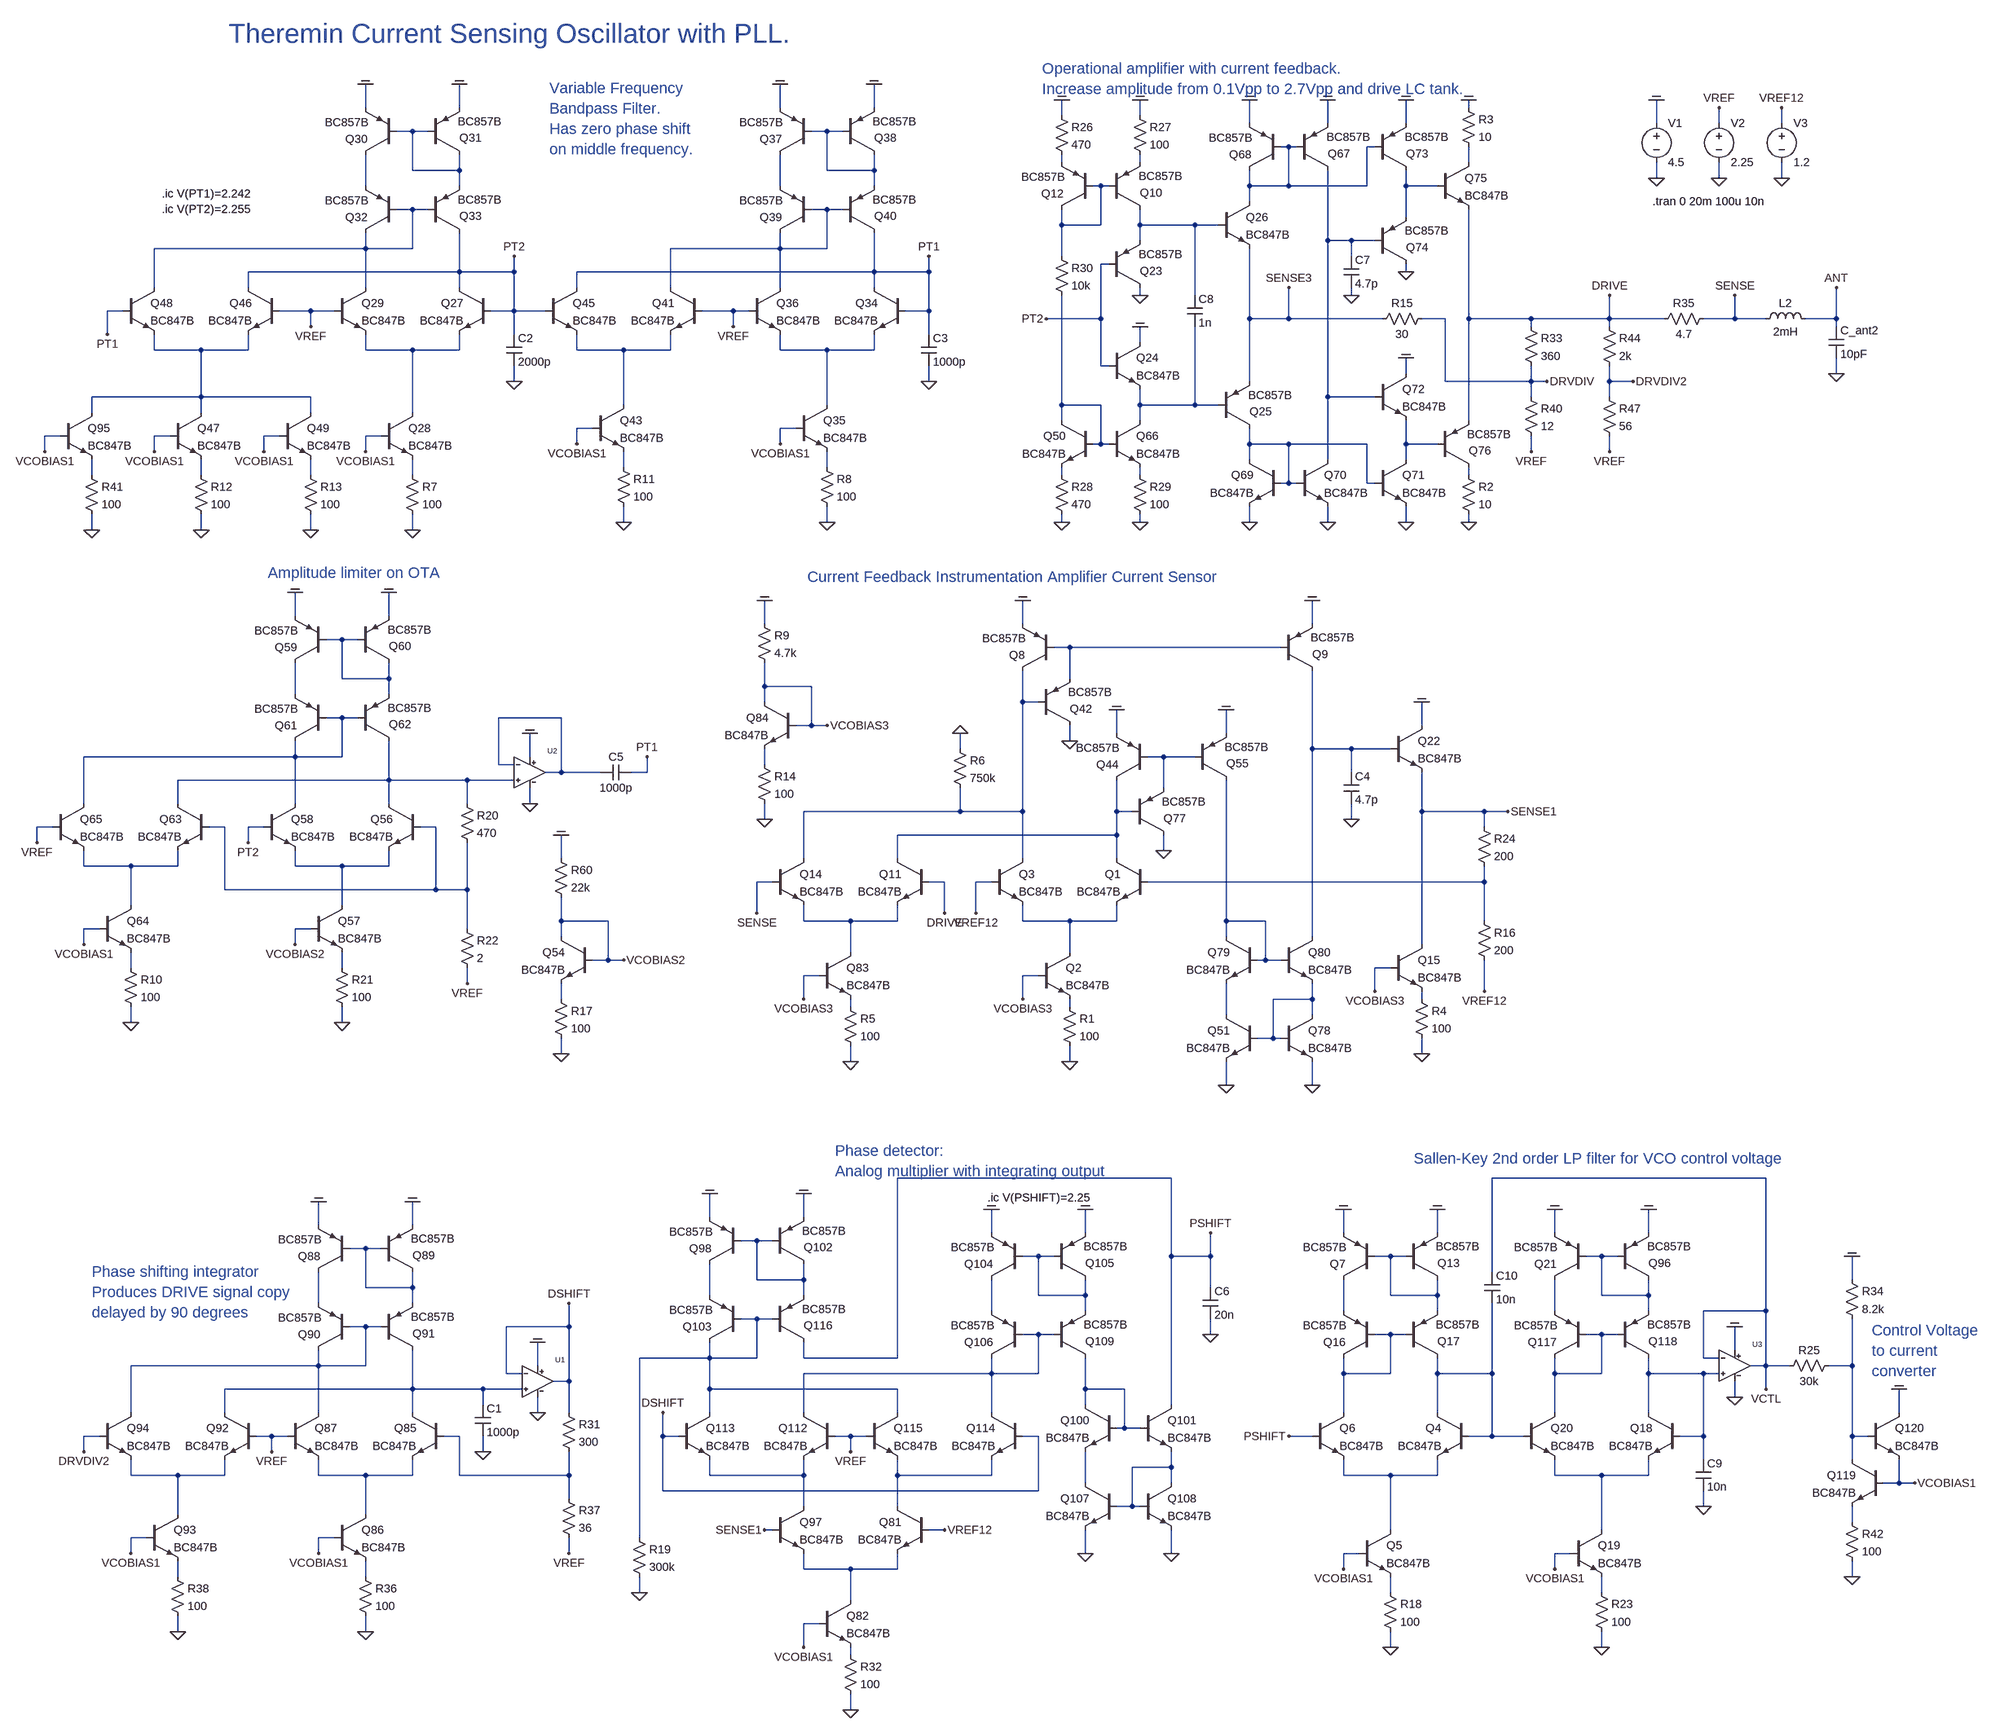
[diagram p0: schematic vco_and_lc_drive_v02.asc]
vco_and_lc_drive_v02.asc, the LTspice schematic file:
Version 4
SHEET 1 13504 21184
WIRE -5552 15856 -5552 15808
WIRE -5360 15856 -5360 15808
WIRE -4704 15856 -4704 15808
WIRE -4512 15856 -4512 15808
WIRE -3296 15856 -3296 15840
WIRE -4128 15872 -4128 15840
WIRE -3968 15872 -3968 15840
WIRE -3744 15888 -3744 15840
WIRE -3584 15888 -3584 15840
WIRE -3424 15888 -3424 15840
WIRE -2912 15888 -2912 15840
WIRE -2784 15888 -2784 15856
WIRE -2656 15888 -2656 15856
WIRE -5456 15904 -5488 15904
WIRE -5424 15904 -5456 15904
WIRE -4608 15904 -4640 15904
WIRE -4576 15904 -4608 15904
WIRE -3664 15936 -3680 15936
WIRE -3648 15936 -3664 15936
WIRE -3488 15936 -3504 15936
WIRE -4128 15968 -4128 15952
WIRE -3968 15968 -3968 15952
WIRE -3296 15968 -3296 15936
WIRE -5456 15984 -5456 15904
WIRE -5360 15984 -5360 15952
WIRE -5360 15984 -5456 15984
WIRE -4608 15984 -4608 15904
WIRE -4512 15984 -4512 15952
WIRE -4512 15984 -4608 15984
WIRE -2912 16000 -2912 15968
WIRE -2784 16000 -2784 15968
WIRE -2656 16000 -2656 15968
WIRE -5552 16016 -5552 15952
WIRE -5360 16016 -5360 15984
WIRE -4704 16016 -4704 15952
WIRE -4512 16016 -4512 15984
WIRE -4048 16016 -4064 16016
WIRE -4032 16016 -4048 16016
WIRE -3744 16016 -3744 15984
WIRE -3664 16016 -3664 15936
WIRE -3664 16016 -3744 16016
WIRE -3504 16016 -3504 15936
WIRE -3504 16016 -3664 16016
WIRE -3424 16016 -3424 15984
WIRE -3360 16016 -3424 16016
WIRE -3744 16048 -3744 16016
WIRE -5456 16064 -5488 16064
WIRE -5424 16064 -5456 16064
WIRE -4608 16064 -4640 16064
WIRE -4576 16064 -4608 16064
WIRE -3424 16080 -3424 16016
WIRE -4128 16096 -4128 16064
WIRE -4048 16096 -4048 16016
WIRE -4048 16096 -4128 16096
WIRE -3968 16096 -3968 16064
WIRE -3856 16096 -3968 16096
WIRE -3808 16096 -3856 16096
WIRE -3968 16128 -3968 16096
WIRE -3584 16128 -3584 15984
WIRE -3536 16128 -3584 16128
WIRE -3488 16128 -3536 16128
WIRE -5552 16144 -5552 16112
WIRE -5552 16144 -5984 16144
WIRE -5456 16144 -5456 16064
WIRE -5456 16144 -5552 16144
WIRE -4704 16144 -4704 16112
WIRE -4704 16144 -4928 16144
WIRE -4608 16144 -4608 16064
WIRE -4608 16144 -4704 16144
WIRE -4128 16160 -4128 16096
WIRE -3536 16160 -3536 16128
WIRE -4032 16176 -4048 16176
WIRE -5360 16192 -5360 16112
WIRE -5360 16192 -5792 16192
WIRE -5248 16192 -5248 16160
WIRE -5248 16192 -5360 16192
WIRE -4512 16192 -4512 16112
WIRE -4512 16192 -5120 16192
WIRE -4400 16192 -4400 16160
WIRE -4400 16192 -4512 16192
WIRE -3424 16192 -3424 16176
WIRE -5984 16224 -5984 16144
WIRE -5792 16224 -5792 16192
WIRE -5552 16224 -5552 16144
WIRE -5360 16224 -5360 16192
WIRE -5120 16224 -5120 16192
WIRE -4928 16224 -4928 16144
WIRE -4704 16224 -4704 16144
WIRE -4512 16224 -4512 16192
WIRE -3968 16240 -3968 16224
WIRE -3856 16240 -3856 16096
WIRE -3536 16240 -3536 16224
WIRE -6048 16272 -6080 16272
WIRE -5664 16272 -5728 16272
WIRE -5616 16272 -5664 16272
WIRE -5248 16272 -5248 16192
WIRE -5248 16272 -5296 16272
WIRE -5184 16272 -5248 16272
WIRE -4800 16272 -4864 16272
WIRE -4768 16272 -4800 16272
WIRE -4400 16272 -4400 16192
WIRE -4400 16272 -4448 16272
WIRE -4048 16288 -4048 16176
WIRE -4048 16288 -4160 16288
WIRE -3744 16288 -3744 16144
WIRE -3664 16288 -3664 16224
WIRE -3664 16288 -3744 16288
WIRE -3472 16288 -3664 16288
WIRE -3344 16288 -3392 16288
WIRE -3296 16288 -3296 16064
WIRE -3168 16288 -3296 16288
WIRE -3008 16288 -3008 16240
WIRE -3008 16288 -3168 16288
WIRE -2896 16288 -3008 16288
WIRE -2752 16288 -2752 16240
WIRE -2752 16288 -2816 16288
WIRE -2688 16288 -2752 16288
WIRE -2544 16288 -2544 16224
WIRE -2544 16288 -2608 16288
WIRE -5664 16304 -5664 16272
WIRE -4800 16304 -4800 16272
WIRE -3168 16304 -3168 16288
WIRE -3008 16304 -3008 16288
WIRE -2544 16304 -2544 16288
WIRE -6080 16320 -6080 16272
WIRE -5248 16320 -5248 16272
WIRE -4400 16320 -4400 16272
WIRE -3968 16336 -3968 16304
WIRE -5984 16352 -5984 16320
WIRE -5888 16352 -5984 16352
WIRE -5792 16352 -5792 16320
WIRE -5792 16352 -5888 16352
WIRE -5552 16352 -5552 16320
WIRE -5456 16352 -5552 16352
WIRE -5360 16352 -5360 16320
WIRE -5360 16352 -5456 16352
WIRE -5120 16352 -5120 16320
WIRE -5024 16352 -5120 16352
WIRE -4928 16352 -4928 16320
WIRE -4928 16352 -5024 16352
WIRE -4704 16352 -4704 16320
WIRE -4608 16352 -4704 16352
WIRE -4512 16352 -4512 16320
WIRE -4512 16352 -4608 16352
WIRE -4048 16384 -4048 16288
WIRE -4032 16384 -4048 16384
WIRE -3424 16400 -3424 16368
WIRE -2544 16400 -2544 16368
WIRE -5248 16416 -5248 16384
WIRE -4400 16416 -4400 16384
WIRE -3744 16416 -3744 16288
WIRE -3344 16416 -3344 16288
WIRE -3168 16416 -3168 16384
WIRE -3168 16416 -3344 16416
WIRE -3136 16416 -3168 16416
WIRE -3008 16416 -3008 16384
WIRE -2960 16416 -3008 16416
WIRE -5888 16448 -5888 16352
WIRE -5888 16448 -6112 16448
WIRE -5664 16448 -5888 16448
WIRE -3584 16448 -3584 16128
WIRE -3488 16448 -3584 16448
WIRE -3168 16448 -3168 16416
WIRE -3008 16448 -3008 16416
WIRE -5024 16464 -5024 16352
WIRE -4608 16464 -4608 16352
WIRE -4128 16464 -4128 16240
WIRE -4048 16464 -4128 16464
WIRE -3968 16464 -3968 16432
WIRE -3856 16464 -3856 16304
WIRE -3856 16464 -3968 16464
WIRE -3808 16464 -3856 16464
WIRE -6112 16480 -6112 16448
WIRE -5888 16480 -5888 16448
WIRE -5664 16480 -5664 16448
WIRE -5456 16480 -5456 16352
WIRE -4128 16496 -4128 16464
WIRE -3968 16496 -3968 16464
WIRE -3296 16496 -3296 16288
WIRE -5088 16512 -5120 16512
WIRE -4672 16512 -4704 16512
WIRE -6176 16528 -6208 16528
WIRE -5952 16528 -5984 16528
WIRE -5728 16528 -5760 16528
WIRE -5520 16528 -5552 16528
WIRE -5120 16544 -5120 16512
WIRE -4704 16544 -4704 16512
WIRE -4048 16544 -4048 16464
WIRE -4048 16544 -4064 16544
WIRE -4032 16544 -4048 16544
WIRE -3744 16544 -3744 16512
WIRE -3664 16544 -3744 16544
WIRE -3504 16544 -3664 16544
WIRE -3424 16544 -3424 16496
WIRE -3360 16544 -3424 16544
WIRE -6208 16560 -6208 16528
WIRE -5984 16560 -5984 16528
WIRE -5760 16560 -5760 16528
WIRE -5552 16560 -5552 16528
WIRE -3168 16560 -3168 16528
WIRE -3008 16560 -3008 16528
WIRE -3744 16576 -3744 16544
WIRE -3584 16576 -3584 16448
WIRE -3424 16576 -3424 16544
WIRE -5024 16592 -5024 16560
WIRE -4608 16592 -4608 16560
WIRE -6112 16608 -6112 16576
WIRE -5888 16608 -5888 16576
WIRE -5664 16608 -5664 16576
WIRE -5456 16608 -5456 16576
WIRE -4128 16608 -4128 16592
WIRE -3968 16608 -3968 16592
WIRE -3296 16608 -3296 16592
WIRE -3664 16624 -3664 16544
WIRE -3664 16624 -3680 16624
WIRE -3648 16624 -3664 16624
WIRE -3504 16624 -3504 16544
WIRE -3488 16624 -3504 16624
WIRE -5024 16704 -5024 16672
WIRE -4608 16704 -4608 16672
WIRE -4128 16704 -4128 16688
WIRE -3968 16704 -3968 16688
WIRE -3744 16704 -3744 16672
WIRE -3584 16704 -3584 16672
WIRE -3424 16704 -3424 16672
WIRE -3296 16704 -3296 16688
WIRE -6112 16720 -6112 16688
WIRE -5888 16720 -5888 16688
WIRE -5664 16720 -5664 16688
WIRE -5456 16720 -5456 16688
WIRE -5696 16896 -5696 16848
WIRE -5504 16896 -5504 16848
WIRE -4736 16912 -4736 16864
WIRE -4208 16912 -4208 16864
WIRE -3616 16912 -3616 16864
WIRE -5600 16944 -5632 16944
WIRE -5568 16944 -5600 16944
WIRE -4112 16960 -4144 16960
WIRE -3680 16960 -4112 16960
WIRE -5600 17024 -5600 16944
WIRE -5504 17024 -5504 16992
WIRE -5504 17024 -5600 17024
WIRE -4112 17024 -4112 16960
WIRE -4736 17040 -4736 16992
WIRE -4640 17040 -4736 17040
WIRE -5696 17056 -5696 16992
WIRE -5504 17056 -5504 17024
WIRE -4736 17072 -4736 17040
WIRE -4208 17072 -4208 17008
WIRE -4176 17072 -4208 17072
WIRE -5600 17104 -5632 17104
WIRE -5568 17104 -5600 17104
WIRE -5152 17104 -5280 17104
WIRE -4640 17120 -4640 17040
WIRE -4640 17120 -4672 17120
WIRE -4608 17120 -4640 17120
WIRE -3392 17120 -3392 17072
WIRE -4016 17136 -4016 17088
WIRE -3792 17136 -3792 17088
WIRE -4112 17152 -4112 17120
WIRE -4336 17168 -4336 17136
WIRE -3616 17168 -3616 17008
WIRE -3536 17168 -3616 17168
WIRE -3456 17168 -3536 17168
WIRE -5696 17184 -5696 17152
WIRE -5696 17184 -6128 17184
WIRE -5600 17184 -5600 17104
WIRE -5600 17184 -5696 17184
WIRE -5216 17184 -5216 17136
WIRE -3920 17184 -3952 17184
WIRE -3856 17184 -3920 17184
WIRE -5280 17200 -5280 17104
WIRE -5248 17200 -5280 17200
WIRE -4736 17200 -4736 17168
WIRE -5152 17216 -5152 17104
WIRE -5152 17216 -5184 17216
WIRE -5072 17216 -5152 17216
WIRE -4976 17216 -4976 17184
WIRE -4976 17216 -5008 17216
WIRE -3536 17216 -3536 17168
WIRE -5504 17232 -5504 17152
WIRE -5504 17232 -5936 17232
WIRE -5344 17232 -5504 17232
WIRE -5248 17232 -5344 17232
WIRE -3920 17248 -3920 17184
WIRE -6128 17280 -6128 17184
WIRE -5936 17280 -5936 17232
WIRE -5696 17280 -5696 17184
WIRE -5504 17280 -5504 17232
WIRE -5344 17280 -5344 17232
WIRE -5216 17280 -5216 17248
WIRE -4336 17296 -4336 17248
WIRE -4336 17296 -4656 17296
WIRE -4208 17296 -4208 17072
WIRE -4208 17296 -4336 17296
WIRE -4016 17296 -4016 17232
WIRE -3984 17296 -4016 17296
WIRE -3392 17296 -3392 17216
WIRE -3264 17296 -3392 17296
WIRE -3216 17296 -3264 17296
WIRE -4736 17312 -4736 17280
WIRE -3536 17312 -3536 17280
WIRE -6192 17328 -6224 17328
WIRE -5840 17328 -5872 17328
WIRE -5760 17328 -5792 17328
WIRE -5408 17328 -5440 17328
WIRE -3264 17328 -3264 17296
WIRE -4016 17344 -4016 17296
WIRE -4016 17344 -4464 17344
WIRE -6224 17360 -6224 17328
WIRE -5792 17360 -5792 17328
WIRE -3920 17376 -3920 17344
WIRE -5152 17392 -5152 17344
WIRE -4656 17392 -4656 17296
WIRE -4464 17392 -4464 17344
WIRE -4208 17392 -4208 17296
WIRE -4016 17392 -4016 17344
WIRE -6128 17408 -6128 17376
WIRE -6032 17408 -6128 17408
WIRE -5936 17408 -5936 17376
WIRE -5936 17408 -6032 17408
WIRE -5696 17408 -5696 17376
WIRE -5600 17408 -5696 17408
WIRE -5504 17408 -5504 17376
WIRE -5504 17408 -5600 17408
WIRE -4720 17440 -4752 17440
WIRE -4368 17440 -4400 17440
WIRE -4272 17440 -4304 17440
WIRE -3264 17440 -3264 17408
WIRE -3264 17440 -3952 17440
WIRE -5840 17456 -5840 17328
WIRE -5408 17456 -5408 17328
WIRE -5408 17456 -5840 17456
WIRE -5344 17456 -5344 17360
WIRE -5344 17456 -5408 17456
WIRE -6032 17488 -6032 17408
WIRE -5600 17488 -5600 17408
WIRE -4752 17504 -4752 17440
WIRE -4368 17504 -4368 17440
WIRE -4304 17504 -4304 17440
WIRE -5152 17520 -5152 17472
WIRE -5056 17520 -5152 17520
WIRE -4656 17520 -4656 17488
WIRE -4560 17520 -4656 17520
WIRE -4464 17520 -4464 17488
WIRE -4464 17520 -4560 17520
WIRE -4208 17520 -4208 17488
WIRE -4112 17520 -4208 17520
WIRE -4016 17520 -4016 17488
WIRE -4016 17520 -4112 17520
WIRE -3792 17520 -3792 17232
WIRE -3712 17520 -3792 17520
WIRE -3264 17520 -3264 17440
WIRE -6096 17536 -6128 17536
WIRE -5664 17536 -5696 17536
WIRE -5344 17536 -5344 17456
WIRE -5152 17552 -5152 17520
WIRE -3792 17552 -3792 17520
WIRE -3616 17552 -3616 17168
WIRE -6128 17568 -6128 17536
WIRE -5696 17568 -5696 17536
WIRE -3392 17568 -3392 17296
WIRE -4560 17584 -4560 17520
WIRE -4112 17584 -4112 17520
WIRE -5056 17600 -5056 17520
WIRE -5056 17600 -5088 17600
WIRE -5024 17600 -5056 17600
WIRE -3712 17600 -3712 17520
WIRE -3712 17600 -3728 17600
WIRE -3680 17600 -3712 17600
WIRE -6032 17616 -6032 17584
WIRE -5600 17616 -5600 17584
WIRE -3456 17616 -3488 17616
WIRE -4624 17632 -4656 17632
WIRE -4176 17632 -4208 17632
WIRE -5344 17648 -5344 17616
WIRE -3488 17664 -3488 17616
WIRE -3264 17664 -3264 17600
WIRE -5152 17680 -5152 17648
WIRE -4656 17680 -4656 17632
WIRE -4208 17680 -4208 17632
WIRE -3616 17680 -3616 17648
WIRE -3616 17680 -3696 17680
WIRE -3392 17680 -3392 17664
WIRE -4560 17696 -4560 17680
WIRE -4112 17696 -4112 17680
WIRE -3792 17712 -3792 17648
WIRE -3616 17712 -3616 17680
WIRE -6032 17728 -6032 17696
WIRE -5600 17728 -5600 17696
WIRE -3696 17760 -3696 17680
WIRE -3696 17760 -3728 17760
WIRE -3680 17760 -3696 17760
WIRE -5152 17792 -5152 17760
WIRE -3392 17792 -3392 17760
WIRE -4560 17808 -4560 17776
WIRE -4112 17808 -4112 17776
WIRE -3792 17856 -3792 17808
WIRE -3616 17856 -3616 17808
WIRE -3904 18096 -4464 18096
WIRE -2688 18096 -3248 18096
WIRE -4848 18176 -4848 18128
WIRE -4656 18176 -4656 18128
WIRE -5648 18192 -5648 18144
WIRE -5456 18192 -5456 18144
WIRE -4272 18208 -4272 18160
WIRE -4080 18208 -4080 18160
WIRE -3552 18208 -3552 18160
WIRE -3360 18208 -3360 18160
WIRE -3120 18208 -3120 18160
WIRE -2928 18208 -2928 18160
WIRE -4752 18224 -4784 18224
WIRE -4720 18224 -4752 18224
WIRE -5552 18240 -5584 18240
WIRE -5520 18240 -5552 18240
WIRE -4176 18256 -4208 18256
WIRE -4144 18256 -4176 18256
WIRE -3904 18256 -3904 18096
WIRE -3824 18256 -3824 18208
WIRE -3824 18256 -3904 18256
WIRE -3456 18256 -3488 18256
WIRE -3424 18256 -3456 18256
WIRE -3024 18256 -3056 18256
WIRE -2992 18256 -3024 18256
WIRE -3248 18288 -3248 18096
WIRE -4752 18304 -4752 18224
WIRE -4656 18304 -4656 18272
WIRE -4656 18304 -4752 18304
WIRE -2512 18304 -2512 18256
WIRE -5552 18320 -5552 18240
WIRE -5456 18320 -5456 18288
WIRE -5456 18320 -5552 18320
WIRE -3824 18320 -3824 18256
WIRE -4848 18336 -4848 18272
WIRE -4656 18336 -4656 18304
WIRE -4176 18336 -4176 18256
WIRE -4080 18336 -4080 18304
WIRE -4080 18336 -4176 18336
WIRE -3456 18336 -3456 18256
WIRE -3360 18336 -3360 18304
WIRE -3360 18336 -3456 18336
WIRE -3024 18336 -3024 18256
WIRE -2928 18336 -2928 18304
WIRE -2928 18336 -3024 18336
WIRE -5648 18352 -5648 18288
WIRE -5456 18352 -5456 18320
WIRE -4272 18368 -4272 18304
WIRE -4080 18368 -4080 18336
WIRE -3552 18368 -3552 18304
WIRE -3360 18368 -3360 18336
WIRE -3120 18368 -3120 18304
WIRE -2928 18368 -2928 18336
WIRE -2688 18368 -2688 18096
WIRE -2688 18368 -2816 18368
WIRE -4752 18384 -4784 18384
WIRE -4720 18384 -4752 18384
WIRE -5552 18400 -5584 18400
WIRE -5520 18400 -5552 18400
WIRE -5136 18400 -5136 18352
WIRE -5136 18400 -5264 18400
WIRE -4176 18416 -4208 18416
WIRE -4144 18416 -4176 18416
WIRE -3824 18416 -3824 18384
WIRE -3456 18416 -3488 18416
WIRE -3424 18416 -3456 18416
WIRE -3024 18416 -3056 18416
WIRE -2992 18416 -3024 18416
WIRE -2752 18448 -2752 18400
WIRE -4848 18464 -4848 18432
WIRE -4848 18464 -4992 18464
WIRE -4752 18464 -4752 18384
WIRE -4752 18464 -4848 18464
WIRE -4656 18464 -4656 18432
WIRE -4464 18464 -4464 18096
WIRE -4464 18464 -4656 18464
WIRE -2816 18464 -2816 18368
WIRE -2784 18464 -2816 18464
WIRE -5648 18480 -5648 18448
WIRE -5648 18480 -6032 18480
WIRE -5552 18480 -5552 18400
WIRE -5552 18480 -5648 18480
WIRE -5200 18480 -5200 18432
WIRE -2688 18480 -2688 18368
WIRE -2688 18480 -2720 18480
WIRE -2640 18480 -2688 18480
WIRE -2512 18480 -2512 18384
WIRE -2512 18480 -2560 18480
WIRE -5264 18496 -5264 18400
WIRE -5232 18496 -5264 18496
WIRE -4272 18496 -4272 18464
WIRE -4272 18496 -4656 18496
WIRE -4176 18496 -4176 18416
WIRE -4176 18496 -4272 18496
WIRE -3552 18496 -3552 18464
WIRE -3456 18496 -3456 18416
WIRE -3456 18496 -3552 18496
WIRE -3360 18496 -3360 18464
WIRE -3248 18496 -3248 18352
WIRE -3248 18496 -3360 18496
WIRE -3120 18496 -3120 18464
WIRE -3024 18496 -3024 18416
WIRE -3024 18496 -3120 18496
WIRE -2928 18496 -2928 18464
WIRE -2816 18496 -2928 18496
WIRE -2784 18496 -2816 18496
WIRE -5136 18512 -5136 18400
WIRE -5136 18512 -5168 18512
WIRE -5456 18528 -5456 18448
WIRE -5456 18528 -5840 18528
WIRE -5312 18528 -5456 18528
WIRE -5232 18528 -5312 18528
WIRE -4848 18528 -4848 18464
WIRE -4464 18528 -4848 18528
WIRE -4080 18528 -4080 18464
WIRE -4000 18528 -4080 18528
WIRE -2688 18528 -2688 18480
WIRE -2752 18544 -2752 18512
WIRE -5312 18560 -5312 18528
WIRE -4080 18560 -4080 18528
WIRE -3904 18560 -3904 18256
WIRE -6032 18576 -6032 18480
WIRE -5840 18576 -5840 18528
WIRE -5648 18576 -5648 18480
WIRE -5456 18576 -5456 18528
WIRE -5200 18576 -5200 18544
WIRE -5136 18576 -5136 18512
WIRE -4848 18576 -4848 18528
WIRE -4656 18576 -4656 18496
WIRE -4464 18576 -4464 18528
WIRE -4272 18576 -4272 18496
WIRE -3552 18576 -3552 18496
WIRE -3360 18576 -3360 18496
WIRE -3120 18576 -3120 18496
WIRE -2928 18576 -2928 18496
WIRE -2416 18576 -2416 18528
WIRE -4000 18608 -4000 18528
WIRE -4000 18608 -4016 18608
WIRE -3968 18608 -4000 18608
WIRE -6096 18624 -6128 18624
WIRE -5744 18624 -5776 18624
WIRE -5712 18624 -5744 18624
WIRE -5360 18624 -5392 18624
WIRE -4944 18624 -4944 18576
WIRE -4912 18624 -4944 18624
WIRE -4560 18624 -4592 18624
WIRE -4528 18624 -4560 18624
WIRE -4176 18624 -4208 18624
WIRE -3616 18624 -3664 18624
WIRE -3248 18624 -3248 18496
WIRE -3248 18624 -3296 18624
WIRE -3184 18624 -3248 18624
WIRE -2816 18624 -2816 18496
WIRE -2816 18624 -2864 18624
WIRE -2512 18624 -2512 18480
WIRE -2480 18624 -2512 18624
WIRE -6128 18656 -6128 18624
WIRE -5744 18656 -5744 18624
WIRE -5312 18656 -5312 18624
WIRE -4560 18656 -4560 18624
WIRE -2816 18672 -2816 18624
WIRE -2512 18672 -2512 18624
WIRE -3904 18688 -3904 18656
WIRE -3904 18688 -3984 18688
WIRE -6032 18704 -6032 18672
WIRE -5936 18704 -6032 18704
WIRE -5840 18704 -5840 18672
WIRE -5840 18704 -5936 18704
WIRE -5648 18704 -5648 18672
WIRE -5552 18704 -5648 18704
WIRE -5456 18704 -5456 18672
WIRE -5456 18704 -5552 18704
WIRE -5360 18704 -5360 18624
WIRE -5136 18704 -5136 18656
WIRE -5136 18704 -5360 18704
WIRE -4848 18704 -4848 18672
WIRE -4656 18704 -4656 18672
WIRE -4656 18704 -4848 18704
WIRE -4464 18704 -4464 18672
WIRE -4272 18704 -4272 18672
WIRE -4272 18704 -4464 18704
WIRE -3552 18704 -3552 18672
WIRE -3456 18704 -3552 18704
WIRE -3360 18704 -3360 18672
WIRE -3360 18704 -3456 18704
WIRE -3120 18704 -3120 18672
WIRE -3024 18704 -3120 18704
WIRE -2928 18704 -2928 18672
WIRE -2928 18704 -3024 18704
WIRE -4080 18720 -4080 18656
WIRE -3904 18720 -3904 18688
WIRE -2416 18720 -2416 18672
WIRE -2416 18720 -2448 18720
WIRE -2384 18720 -2416 18720
WIRE -4944 18736 -4944 18624
WIRE -4176 18736 -4176 18624
WIRE -4176 18736 -4944 18736
WIRE -5136 18752 -5136 18704
WIRE -4656 18768 -4656 18704
WIRE -4464 18768 -4464 18704
WIRE -3984 18768 -3984 18688
WIRE -3984 18768 -4016 18768
WIRE -3968 18768 -3984 18768
WIRE -2816 18768 -2816 18736
WIRE -5936 18784 -5936 18704
WIRE -5552 18784 -5552 18704
WIRE -2512 18800 -2512 18768
WIRE -4720 18816 -4736 18816
WIRE -4368 18816 -4400 18816
WIRE -3456 18816 -3456 18704
WIRE -3024 18816 -3024 18704
WIRE -6000 18832 -6032 18832
WIRE -5616 18832 -5648 18832
WIRE -4992 18832 -4992 18464
WIRE -6032 18864 -6032 18832
WIRE -5648 18864 -5648 18832
WIRE -5136 18864 -5136 18832
WIRE -4080 18864 -4080 18816
WIRE -3904 18864 -3904 18816
WIRE -3520 18864 -3552 18864
WIRE -3088 18864 -3120 18864
WIRE -4656 18896 -4656 18864
WIRE -4560 18896 -4656 18896
WIRE -4464 18896 -4464 18864
WIRE -4464 18896 -4560 18896
WIRE -3552 18896 -3552 18864
WIRE -3120 18896 -3120 18864
WIRE -5936 18912 -5936 18880
WIRE -5552 18912 -5552 18880
WIRE -2512 18912 -2512 18880
WIRE -4992 18944 -4992 18912
WIRE -3456 18944 -3456 18912
WIRE -3024 18944 -3024 18912
WIRE -4560 18960 -4560 18896
WIRE -4624 19008 -4656 19008
WIRE -5936 19024 -5936 18992
WIRE -5552 19024 -5552 18992
WIRE -4656 19056 -4656 19008
WIRE -3456 19056 -3456 19024
WIRE -3024 19056 -3024 19024
WIRE -4560 19072 -4560 19056
WIRE -4560 19184 -4560 19152
FLAG -2912 16000 0
FLAG -2912 15840 COM
FLAG -2784 16000 0
FLAG -2784 15856 VREF
FLAG -5152 17344 COM
FLAG -5024 17600 VCOBIAS2
FLAG -5152 17792 0
FLAG -5552 16560 VCOBIAS1
FLAG -5456 16720 0
FLAG -5552 15808 COM
FLAG -5360 15808 COM
FLAG -4704 16544 VCOBIAS1
FLAG -4400 16416 0
FLAG -4704 15808 COM
FLAG -4512 15808 COM
FLAG -5120 16544 VCOBIAS1
FLAG -5024 16704 0
FLAG -4800 16304 VREF
FLAG -5984 16560 VCOBIAS1
FLAG -5888 16720 0
FLAG -5664 16304 VREF
FLAG -5696 17568 VCOBIAS2
FLAG -5344 17648 VREF
FLAG -5600 17728 0
FLAG -5696 16848 COM
FLAG -5504 16848 COM
FLAG -5216 17280 0
FLAG -5216 17136 COM
FLAG -6128 17568 VCOBIAS1
FLAG -6032 17728 0
FLAG -6224 17360 VREF
FLAG -5248 16160 PT2
FLAG -4128 16704 0
FLAG -3968 16704 0
FLAG -3968 15840 COM
FLAG -4128 15840 COM
FLAG -3968 16240 0
FLAG -3968 16304 COM
FLAG -3584 15840 COM
FLAG -3744 15840 COM
FLAG -3744 16704 0
FLAG -3584 16704 0
FLAG -3536 16240 0
FLAG -3424 16704 0
FLAG -3424 16368 COM
FLAG -3424 15840 COM
FLAG -3424 16192 0
FLAG -3296 15840 COM
FLAG -3296 16704 0
FLAG -3168 16560 VREF
FLAG -2544 16400 0
FLAG -2544 16224 ANT
FLAG -2752 16240 SENSE
FLAG -3008 16240 DRIVE
FLAG -3136 16416 DRVDIV
FLAG -2656 16000 0
FLAG -2656 15856 VREF12
FLAG -4112 17808 0
FLAG -4304 17504 VREF12
FLAG -4208 16864 COM
FLAG -3616 16864 COM
FLAG -4208 17680 VCOBIAS3
FLAG -4368 17504 DRIVE
FLAG -4112 17152 0
FLAG -4016 17088 COM
FLAG -3792 17088 COM
FLAG -3920 17376 0
FLAG -4560 17808 0
FLAG -4656 17680 VCOBIAS3
FLAG -4752 17504 SENSE
FLAG -3216 17296 SENSE1
FLAG -4736 16864 COM
FLAG -4608 17120 VCOBIAS3
FLAG -4736 17312 0
FLAG -3264 17664 VREF12
FLAG -5648 18864 VCOBIAS1
FLAG -5136 18864 VREF
FLAG -5552 19024 0
FLAG -5648 18144 COM
FLAG -5456 18144 COM
FLAG -6032 18864 VCOBIAS1
FLAG -5936 19024 0
FLAG -5744 18656 VREF
FLAG -6128 18656 DRVDIV2
FLAG -2960 16416 DRVDIV2
FLAG -4400 16160 PT1
FLAG -4976 17184 PT1
FLAG -6080 16320 PT1
FLAG -5792 17360 PT2
FLAG -5760 16560 VCOBIAS1
FLAG -5664 16720 0
FLAG -6208 16560 VCOBIAS1
FLAG -6112 16720 0
FLAG -4160 16288 PT2
FLAG -3008 16560 VREF
FLAG -5200 18576 0
FLAG -5200 18432 COM
FLAG -3392 17792 0
FLAG -3488 17664 VCOBIAS3
FLAG -3392 17072 COM
FLAG -3536 17312 0
FLAG -4560 19184 0
FLAG -4656 19056 VCOBIAS1
FLAG -4080 18864 0
FLAG -3904 18864 0
FLAG -3824 18208 PSHIFT
FLAG -3824 18416 0
FLAG -4368 18816 VREF12
FLAG -4736 18816 SENSE1
FLAG -5136 18352 DSHIFT
FLAG -4560 18656 VREF
FLAG -4944 18576 DSHIFT
FLAG -4272 18160 COM
FLAG -4080 18160 COM
FLAG -4848 18128 COM
FLAG -4656 18128 COM
FLAG -3552 18896 VCOBIAS1
FLAG -3456 19056 0
FLAG -3552 18160 COM
FLAG -3360 18160 COM
FLAG -3120 18896 VCOBIAS1
FLAG -3024 19056 0
FLAG -3120 18160 COM
FLAG -2928 18160 COM
FLAG -2816 18768 0
FLAG -2752 18544 0
FLAG -2752 18400 COM
FLAG -3664 18624 PSHIFT
FLAG -3792 17856 0
FLAG -3616 17856 0
FLAG -4336 17136 0
FLAG -2512 18256 COM
FLAG -2384 18720 VCOBIAS1
FLAG -2416 18528 COM
FLAG -2512 18912 0
FLAG -5248 16416 0
FLAG -4608 16704 0
FLAG -2688 18528 VCTL
FLAG -5312 18656 0
FLAG -3664 16224 SENSE3
FLAG -4992 18944 0
SYMBOL voltage -2912 15872 R0
SYMATTR InstName V1
SYMATTR Value 4.5
SYMBOL Voltage -2784 15872 R0
SYMATTR InstName V2
SYMATTR Value 2.25
SYMBOL Res -5168 17376 R0
SYMATTR InstName R60
SYMATTR Value 22k
SYMBOL npn -5088 17552 M0
SYMATTR InstName Q54
SYMATTR Value BC847B
SYMBOL Res -5168 17664 R0
SYMATTR InstName R17
SYMATTR Value 100
SYMBOL npn -5296 16224 M0
SYMATTR InstName Q27
SYMATTR Value BC847B
SYMBOL npn -5520 16480 R0
SYMATTR InstName Q28
SYMATTR Value BC847B
SYMBOL npn -5616 16224 R0
SYMATTR InstName Q29
SYMATTR Value BC847B
SYMBOL Res -5472 16592 R0
SYMATTR InstName R7
SYMATTR Value 100
SYMBOL pnp -5488 15952 R180
WINDOW 0 60 32 Left 2
WINDOW 3 58 66 Left 2
SYMATTR InstName Q30
SYMATTR Value BC857B
SYMBOL pnp -5424 15952 M180
WINDOW 0 64 34 Left 2
WINDOW 3 61 68 Left 2
SYMATTR InstName Q31
SYMATTR Value BC857B
SYMBOL pnp -5488 16112 R180
WINDOW 0 60 32 Left 2
WINDOW 3 58 66 Left 2
SYMATTR InstName Q32
SYMATTR Value BC857B
SYMBOL pnp -5424 16112 M180
WINDOW 0 64 34 Left 2
WINDOW 3 61 68 Left 2
SYMATTR InstName Q33
SYMATTR Value BC857B
SYMBOL npn -4448 16224 M0
SYMATTR InstName Q34
SYMATTR Value BC847B
SYMBOL npn -4672 16464 R0
SYMATTR InstName Q35
SYMATTR Value BC847B
SYMBOL npn -4768 16224 R0
SYMATTR InstName Q36
SYMATTR Value BC847B
SYMBOL Res -4624 16576 R0
SYMATTR InstName R8
SYMATTR Value 100
SYMBOL pnp -4640 15952 R180
WINDOW 0 60 32 Left 2
WINDOW 3 58 66 Left 2
SYMATTR InstName Q37
SYMATTR Value BC857B
SYMBOL pnp -4576 15952 M180
WINDOW 0 64 34 Left 2
WINDOW 3 61 68 Left 2
SYMATTR InstName Q38
SYMATTR Value BC857B
SYMBOL pnp -4640 16112 R180
WINDOW 0 60 32 Left 2
WINDOW 3 58 66 Left 2
SYMATTR InstName Q39
SYMATTR Value BC857B
SYMBOL pnp -4576 16112 M180
WINDOW 0 64 34 Left 2
WINDOW 3 61 68 Left 2
SYMATTR InstName Q40
SYMATTR Value BC857B
SYMBOL Cap -5264 16320 R0
SYMATTR InstName C2
SYMATTR Value 2000p
SYMBOL Cap -5008 17200 R90
WINDOW 0 0 32 VBottom 2
WINDOW 3 32 32 VTop 2
SYMATTR InstName C5
SYMATTR Value 1000p
SYMBOL npn -4864 16224 M0
SYMATTR InstName Q41
SYMATTR Value BC847B
SYMBOL npn -5088 16464 R0
SYMATTR InstName Q43
SYMATTR Value BC847B
SYMBOL npn -5184 16224 R0
SYMATTR InstName Q45
SYMATTR Value BC847B
SYMBOL Res -5040 16576 R0
SYMATTR InstName R11
SYMATTR Value 100
SYMBOL npn -5728 16224 M0
SYMATTR InstName Q46
SYMATTR Value BC847B
SYMBOL npn -5952 16480 R0
SYMATTR InstName Q47
SYMATTR Value BC847B
SYMBOL npn -6048 16224 R0
SYMATTR InstName Q48
SYMATTR Value BC847B
SYMBOL Res -5904 16592 R0
SYMATTR InstName R12
SYMATTR Value 100
SYMBOL npn -5440 17280 M0
SYMATTR InstName Q56
SYMATTR Value BC847B
SYMBOL npn -5664 17488 R0
SYMATTR InstName Q57
SYMATTR Value BC847B
SYMBOL npn -5760 17280 R0
SYMATTR InstName Q58
SYMATTR Value BC847B
SYMBOL Res -5360 17264 R0
SYMATTR InstName R20
SYMATTR Value 470
SYMBOL Res -5616 17600 R0
SYMATTR InstName R21
SYMATTR Value 100
SYMBOL Res -5360 17520 R0
SYMATTR InstName R22
SYMATTR Value 2
SYMBOL pnp -5632 16992 R180
WINDOW 0 60 32 Left 2
WINDOW 3 58 66 Left 2
SYMATTR InstName Q59
SYMATTR Value BC857B
SYMBOL pnp -5568 16992 M180
WINDOW 0 64 34 Left 2
WINDOW 3 61 68 Left 2
SYMATTR InstName Q60
SYMATTR Value BC857B
SYMBOL pnp -5632 17152 R180
WINDOW 0 60 32 Left 2
WINDOW 3 58 66 Left 2
SYMATTR InstName Q61
SYMATTR Value BC857B
SYMBOL pnp -5568 17152 M180
WINDOW 0 64 34 Left 2
WINDOW 3 61 68 Left 2
SYMATTR InstName Q62
SYMATTR Value BC857B
SYMBOL MCP6021 -5216 17216 R0
SYMATTR InstName U2
SYMBOL npn -5872 17280 M0
SYMATTR InstName Q63
SYMATTR Value BC847B
SYMBOL npn -6096 17488 R0
SYMATTR InstName Q64
SYMATTR Value BC847B
SYMBOL npn -6192 17280 R0
SYMATTR InstName Q65
SYMATTR Value BC847B
SYMBOL Res -6048 17600 R0
SYMATTR InstName R10
SYMATTR Value 100
SYMBOL pnp -4032 16064 M180
WINDOW 0 64 34 Left 2
WINDOW 3 61 68 Left 2
SYMATTR InstName Q10
SYMATTR Value BC857B
SYMBOL pnp -4064 16064 R180
WINDOW 0 60 32 Left 2
WINDOW 3 58 66 Left 2
SYMATTR InstName Q12
SYMATTR Value BC857B
SYMBOL pnp -4032 16224 M180
WINDOW 0 64 34 Left 2
WINDOW 3 61 68 Left 2
SYMATTR InstName Q23
SYMATTR Value BC857B
SYMBOL npn -4032 16336 R0
SYMATTR InstName Q24
SYMATTR Value BC847B
SYMBOL pnp -3808 16512 M180
WINDOW 0 64 34 Left 2
WINDOW 3 61 68 Left 2
SYMATTR InstName Q25
SYMATTR Value BC857B
SYMBOL npn -3808 16048 R0
SYMATTR InstName Q26
SYMATTR Value BC847B
SYMBOL Res -4144 15856 R0
SYMATTR InstName R26
SYMATTR Value 470
SYMBOL Res -3984 15856 R0
SYMATTR InstName R27
SYMATTR Value 100
SYMBOL Res -4144 16592 R0
SYMATTR InstName R28
SYMATTR Value 470
SYMBOL Res -3984 16592 R0
SYMATTR InstName R29
SYMATTR Value 100
SYMBOL npn -4064 16496 M0
SYMATTR InstName Q50
SYMATTR Value BC847B
SYMBOL npn -4032 16496 R0
SYMATTR InstName Q66
SYMATTR Value BC847B
SYMBOL Res -4144 16144 R0
SYMATTR InstName R30
SYMATTR Value 10k
SYMBOL pnp -3648 15984 M180
WINDOW 0 64 34 Left 2
WINDOW 3 61 68 Left 2
SYMATTR InstName Q67
SYMATTR Value BC857B
SYMBOL pnp -3680 15984 R180
WINDOW 0 60 32 Left 2
WINDOW 3 58 66 Left 2
SYMATTR InstName Q68
SYMATTR Value BC857B
SYMBOL npn -3680 16576 M0
SYMATTR InstName Q69
SYMATTR Value BC847B
SYMBOL npn -3648 16576 R0
SYMATTR InstName Q70
SYMATTR Value BC847B
SYMBOL Cap -3552 16160 R0
SYMATTR InstName C7
SYMATTR Value 4.7p
SYMBOL npn -3488 16576 R0
SYMATTR InstName Q71
SYMATTR Value BC847B
SYMBOL npn -3488 16400 R0
SYMATTR InstName Q72
SYMATTR Value BC847B
SYMBOL pnp -3488 15984 M180
WINDOW 0 64 34 Left 2
WINDOW 3 61 68 Left 2
SYMATTR InstName Q73
SYMATTR Value BC857B
SYMBOL pnp -3488 16176 M180
WINDOW 0 64 34 Left 2
WINDOW 3 61 68 Left 2
SYMATTR InstName Q74
SYMATTR Value BC857B
SYMBOL npn -3360 15968 R0
SYMATTR InstName Q75
SYMATTR Value BC847B
SYMBOL pnp -3360 16592 M180
WINDOW 0 64 34 Left 2
WINDOW 3 61 68 Left 2
SYMATTR InstName Q76
SYMATTR Value BC857B
SYMBOL Res -3184 16288 R0
SYMATTR InstName R33
SYMATTR Value 360
SYMBOL ind -2704 16304 R270
WINDOW 0 32 56 VTop 2
WINDOW 3 5 56 VBottom 2
SYMATTR InstName L2
SYMATTR Value 2mH
SYMATTR SpiceLine Rser=120 Cpar=1pF
SYMBOL Cap -2560 16304 R0
SYMATTR InstName C_ant2
SYMATTR Value 10pF
SYMBOL Res -2912 16304 R270
WINDOW 0 32 56 VTop 2
WINDOW 3 0 56 VBottom 2
SYMATTR InstName R35
SYMATTR Value 4.7
SYMBOL Cap -3872 16240 R0
SYMATTR InstName C8
SYMATTR Value 1n
SYMBOL Res -3312 16592 R0
SYMATTR InstName R2
SYMATTR Value 10
SYMBOL Res -3312 15840 R0
SYMATTR InstName R3
SYMATTR Value 10
SYMBOL Voltage -2656 15872 R0
SYMATTR InstName V3
SYMATTR Value 1.2
SYMBOL npn -3952 17392 M0
SYMATTR InstName Q1
SYMATTR Value BC847B
SYMBOL npn -4176 17584 R0
SYMATTR InstName Q2
SYMATTR Value BC847B
SYMBOL Res -4128 17680 R0
SYMATTR InstName R1
SYMATTR Value 100
SYMBOL npn -4272 17392 R0
SYMATTR InstName Q3
SYMATTR Value BC847B
SYMBOL pnp -4144 17008 R180
WINDOW 0 60 32 Left 2
WINDOW 3 58 66 Left 2
SYMATTR InstName Q8
SYMATTR Value BC857B
SYMBOL pnp -3680 17008 M180
WINDOW 0 64 34 Left 2
WINDOW 3 61 68 Left 2
SYMATTR InstName Q9
SYMATTR Value BC857B
SYMBOL npn -4400 17392 M0
SYMATTR InstName Q11
SYMATTR Value BC847B
SYMBOL npn -4720 17392 R0
SYMATTR InstName Q14
SYMATTR Value BC847B
SYMBOL pnp -4176 17120 M180
WINDOW 0 64 34 Left 2
WINDOW 3 61 68 Left 2
SYMATTR InstName Q42
SYMATTR Value BC857B
SYMBOL pnp -3952 17232 R180
WINDOW 0 60 32 Left 2
WINDOW 3 58 66 Left 2
SYMATTR InstName Q44
SYMATTR Value BC857B
SYMBOL pnp -3856 17232 M180
WINDOW 0 64 34 Left 2
WINDOW 3 61 68 Left 2
SYMATTR InstName Q55
SYMATTR Value BC857B
SYMBOL pnp -3984 17344 M180
WINDOW 0 64 34 Left 2
WINDOW 3 61 68 Left 2
SYMATTR InstName Q77
SYMATTR Value BC857B
SYMBOL npn -4624 17584 R0
SYMATTR InstName Q83
SYMATTR Value BC847B
SYMBOL Res -4576 17680 R0
SYMATTR InstName R5
SYMATTR Value 100
SYMBOL Res -4352 17152 R0
SYMATTR InstName R6
SYMATTR Value 750k
SYMBOL Res -4752 16896 R0
SYMATTR InstName R9
SYMATTR Value 4.7k
SYMBOL npn -4672 17072 M0
SYMATTR InstName Q84
SYMATTR Value BC847B
SYMBOL Res -4752 17184 R0
SYMATTR InstName R14
SYMATTR Value 100
SYMBOL Res -3280 17504 R0
SYMATTR InstName R16
SYMATTR Value 200
SYMBOL Res -3280 17312 R0
SYMATTR InstName R24
SYMATTR Value 200
SYMBOL npn -5392 18576 M0
SYMATTR InstName Q85
SYMATTR Value BC847B
SYMBOL npn -5616 18784 R0
SYMATTR InstName Q86
SYMATTR Value BC847B
SYMBOL npn -5712 18576 R0
SYMATTR InstName Q87
SYMATTR Value BC847B
SYMBOL Res -5568 18896 R0
SYMATTR InstName R36
SYMATTR Value 100
SYMBOL Res -5152 18736 R0
SYMATTR InstName R37
SYMATTR Value 36
SYMBOL pnp -5584 18288 R180
WINDOW 0 60 32 Left 2
WINDOW 3 58 66 Left 2
SYMATTR InstName Q88
SYMATTR Value BC857B
SYMBOL pnp -5520 18288 M180
WINDOW 0 64 34 Left 2
WINDOW 3 61 68 Left 2
SYMATTR InstName Q89
SYMATTR Value BC857B
SYMBOL pnp -5584 18448 R180
WINDOW 0 60 32 Left 2
WINDOW 3 58 66 Left 2
SYMATTR InstName Q90
SYMATTR Value BC857B
SYMBOL pnp -5520 18448 M180
WINDOW 0 64 34 Left 2
WINDOW 3 61 68 Left 2
SYMATTR InstName Q91
SYMATTR Value BC857B
SYMBOL npn -5776 18576 M0
SYMATTR InstName Q92
SYMATTR Value BC847B
SYMBOL npn -6000 18784 R0
SYMATTR InstName Q93
SYMATTR Value BC847B
SYMBOL npn -6096 18576 R0
SYMATTR InstName Q94
SYMATTR Value BC847B
SYMBOL Res -5952 18896 R0
SYMATTR InstName R38
SYMATTR Value 100
SYMBOL Cap -5328 18560 R0
SYMATTR InstName C1
SYMATTR Value 1000p
SYMBOL Res -5152 18560 R0
SYMATTR InstName R31
SYMATTR Value 300
SYMBOL Res -3184 16432 R0
SYMATTR InstName R40
SYMATTR Value 12
SYMBOL Cap -4416 16320 R0
SYMATTR InstName C3
SYMATTR Value 1000p
SYMBOL npn -5728 16480 R0
SYMATTR InstName Q49
SYMATTR Value BC847B
SYMBOL Res -5680 16592 R0
SYMATTR InstName R13
SYMATTR Value 100
SYMBOL npn -6176 16480 R0
SYMATTR InstName Q95
SYMATTR Value BC847B
SYMBOL Res -6128 16592 R0
SYMATTR InstName R41
SYMATTR Value 100
SYMBOL Res -3024 16288 R0
SYMATTR InstName R44
SYMATTR Value 2k
SYMBOL Res -3024 16432 R0
SYMATTR InstName R47
SYMATTR Value 56
SYMBOL MCP6021 -5200 18512 R0
SYMATTR InstName U1
SYMBOL npn -3456 17568 R0
SYMATTR InstName Q15
SYMATTR Value BC847B
SYMBOL Res -3408 17664 R0
SYMATTR InstName R4
SYMATTR Value 100
SYMBOL npn -3456 17120 R0
SYMATTR InstName Q22
SYMATTR Value BC847B
SYMBOL Cap -3552 17216 R0
SYMATTR InstName C4
SYMATTR Value 4.7p
SYMBOL npn -4400 18768 M0
SYMATTR InstName Q81
SYMATTR Value BC847B
SYMBOL npn -4624 18960 R0
SYMATTR InstName Q82
SYMATTR Value BC847B
SYMBOL Res -4576 19056 R0
SYMATTR InstName R32
SYMATTR Value 100
SYMBOL npn -4720 18768 R0
SYMATTR InstName Q97
SYMATTR Value BC847B
SYMBOL npn -4016 18720 M0
SYMATTR InstName Q107
SYMATTR Value BC847B
SYMBOL npn -3968 18720 R0
SYMATTR InstName Q108
SYMATTR Value BC847B
SYMBOL Cap -3840 18320 R0
SYMATTR InstName C6
SYMATTR Value 20n
SYMBOL npn -4592 18576 M0
SYMATTR InstName Q112
SYMATTR Value BC847B
SYMBOL npn -4912 18576 R0
SYMATTR InstName Q113
SYMATTR Value BC847B
SYMBOL npn -4208 18576 M0
SYMATTR InstName Q114
SYMATTR Value BC847B
SYMBOL npn -4528 18576 R0
SYMATTR InstName Q115
SYMATTR Value BC847B
SYMBOL npn -4016 18560 M0
SYMATTR InstName Q100
SYMATTR Value BC847B
SYMBOL npn -3968 18560 R0
SYMATTR InstName Q101
SYMATTR Value BC847B
SYMBOL pnp -4208 18304 R180
WINDOW 0 60 32 Left 2
WINDOW 3 58 66 Left 2
SYMATTR InstName Q104
SYMATTR Value BC857B
SYMBOL pnp -4144 18304 M180
WINDOW 0 64 34 Left 2
WINDOW 3 61 68 Left 2
SYMATTR InstName Q105
SYMATTR Value BC857B
SYMBOL pnp -4208 18464 R180
WINDOW 0 60 32 Left 2
WINDOW 3 58 66 Left 2
SYMATTR InstName Q106
SYMATTR Value BC857B
SYMBOL pnp -4144 18464 M180
WINDOW 0 64 34 Left 2
WINDOW 3 61 68 Left 2
SYMATTR InstName Q109
SYMATTR Value BC857B
SYMBOL pnp -4784 18272 R180
WINDOW 0 60 32 Left 2
WINDOW 3 58 66 Left 2
SYMATTR InstName Q98
SYMATTR Value BC857B
SYMBOL pnp -4720 18272 M180
WINDOW 0 64 34 Left 2
WINDOW 3 61 68 Left 2
SYMATTR InstName Q102
SYMATTR Value BC857B
SYMBOL pnp -4784 18432 R180
WINDOW 0 60 32 Left 2
WINDOW 3 58 66 Left 2
SYMATTR InstName Q103
SYMATTR Value BC857B
SYMBOL pnp -4720 18432 M180
WINDOW 0 64 34 Left 2
WINDOW 3 61 68 Left 2
SYMATTR InstName Q116
SYMATTR Value BC857B
SYMBOL npn -3296 18576 M0
SYMATTR InstName Q4
SYMATTR Value BC847B
SYMBOL npn -3520 18816 R0
SYMATTR InstName Q5
SYMATTR Value BC847B
SYMBOL npn -3616 18576 R0
SYMATTR InstName Q6
SYMATTR Value BC847B
SYMBOL Res -3472 18928 R0
SYMATTR InstName R18
SYMATTR Value 100
SYMBOL pnp -3488 18304 R180
WINDOW 0 60 32 Left 2
WINDOW 3 58 66 Left 2
SYMATTR InstName Q7
SYMATTR Value BC857B
SYMBOL pnp -3424 18304 M180
WINDOW 0 64 34 Left 2
WINDOW 3 61 68 Left 2
SYMATTR InstName Q13
SYMATTR Value BC857B
SYMBOL pnp -3488 18464 R180
WINDOW 0 60 32 Left 2
WINDOW 3 58 66 Left 2
SYMATTR InstName Q16
SYMATTR Value BC857B
SYMBOL pnp -3424 18464 M180
WINDOW 0 64 34 Left 2
WINDOW 3 61 68 Left 2
SYMATTR InstName Q17
SYMATTR Value BC857B
SYMBOL npn -2864 18576 M0
SYMATTR InstName Q18
SYMATTR Value BC847B
SYMBOL npn -3088 18816 R0
SYMATTR InstName Q19
SYMATTR Value BC847B
SYMBOL npn -3184 18576 R0
SYMATTR InstName Q20
SYMATTR Value BC847B
SYMBOL Res -3040 18928 R0
SYMATTR InstName R23
SYMATTR Value 100
SYMBOL pnp -3056 18304 R180
WINDOW 0 60 32 Left 2
WINDOW 3 58 66 Left 2
SYMATTR InstName Q21
SYMATTR Value BC857B
SYMBOL pnp -2992 18304 M180
WINDOW 0 64 34 Left 2
WINDOW 3 61 68 Left 2
SYMATTR InstName Q96
SYMATTR Value BC857B
SYMBOL pnp -3056 18464 R180
WINDOW 0 60 32 Left 2
WINDOW 3 58 66 Left 2
SYMATTR InstName Q117
SYMATTR Value BC857B
SYMBOL pnp -2992 18464 M180
WINDOW 0 64 34 Left 2
WINDOW 3 61 68 Left 2
SYMATTR InstName Q118
SYMATTR Value BC857B
SYMBOL Cap -2832 18672 R0
SYMATTR InstName C9
SYMATTR Value 10n
SYMBOL Cap -3264 18288 R0
SYMATTR InstName C10
SYMATTR Value 10n
SYMBOL MCP6021 -2752 18480 R0
SYMATTR InstName U3
SYMBOL npn -3728 17712 M0
SYMATTR InstName Q51
SYMATTR Value BC847B
SYMBOL npn -3680 17712 R0
SYMATTR InstName Q78
SYMATTR Value BC847B
SYMBOL npn -3728 17552 M0
SYMATTR InstName Q79
SYMATTR Value BC847B
SYMBOL npn -3680 17552 R0
SYMATTR InstName Q80
SYMATTR Value BC847B
SYMBOL Res -2544 18464 R90
WINDOW 0 0 56 VBottom 2
WINDOW 3 32 56 VTop 2
SYMATTR InstName R25
SYMATTR Value 30k
SYMBOL Res -2528 18288 R0
SYMATTR InstName R34
SYMATTR Value 8.2k
SYMBOL npn -2448 18672 M0
SYMATTR InstName Q119
SYMATTR Value BC847B
SYMBOL npn -2480 18576 R0
SYMATTR InstName Q120
SYMATTR Value BC847B
SYMBOL Res -2528 18784 R0
SYMATTR InstName R42
SYMATTR Value 100
SYMBOL Res -3376 16272 R90
WINDOW 0 0 56 VBottom 2
WINDOW 3 32 56 VTop 2
SYMATTR InstName R15
SYMATTR Value 30
SYMBOL Res -5008 18816 R0
SYMATTR InstName R19
SYMATTR Value 300k
TEXT -2920 16048 Left 2 !.tran 0 20m 100u 10n
TEXT -5832 15704 Left 5 ;Theremin Current Sensing Oscillator with PLL.
TEXT -5968 16032 Left 2 !.ic V(PT1)=2.242\n.ic V(PT2)=2.255
TEXT -4168 15776 Left 3 ;Operational amplifier with current feedback.\nIncrease amplitude from 0.1Vpp to 2.7Vpp and drive LC tank.
TEXT -5752 16808 Left 3 ;Amplitude limiter on OTA
TEXT -5176 15816 Left 3 ;Variable Frequency \nBandpass Filter.\nHas zero phase shift \non middle frequency.
TEXT -4648 16816 Left 3 ;Current Feedback Instrumentation Amplifier Current Sensor
TEXT -6112 18288 Left 3 ;Phase shifting integrator\nProduces DRIVE signal copy \ndelayed by 90 degrees
TEXT -4280 18136 Left 2 !.ic V(PSHIFT)=2.25
TEXT -3408 18056 Left 3 ;Sallen-Key 2nd order LP filter for VCO control voltage
TEXT -4592 18040 Left 3 ;Phase detector:\nAnalog multiplier with integrating output
TEXT -2472 18408 Left 3 ;Control Voltage \nto current\nconverter

The netlist it stands for:
* vco_and_lc_drive_v02.asc
V1 COM 0 4.5
V2 VREF 0 2.25
R60 COM VCOBIAS2 22k
Q54 VCOBIAS2 VCOBIAS2 N052 0 BC847B
R17 N052 0 100
Q27 PT2 PT2 N016 0 BC847B
Q28 N016 VCOBIAS1 N028 0 BC847B
Q29 N011 VREF N016 0 BC847B
R7 N028 0 100
Q30 N007 N001 COM 0 BC857B
Q31 N001 N001 COM 0 BC857B
Q32 N011 N011 N007 0 BC857B
Q33 PT2 N011 N001 0 BC857B
Q34 PT1 PT1 N018 0 BC847B
Q35 N018 VCOBIAS1 N024 0 BC847B
Q36 N012 VREF N018 0 BC847B
R8 N024 0 100
Q37 N008 N002 COM 0 BC857B
Q38 N002 N002 COM 0 BC857B
Q39 N012 N012 N008 0 BC857B
Q40 PT1 N012 N002 0 BC857B
C2 PT2 0 2000p
C5 PT1 N037 1000p
Q41 N012 VREF N017 0 BC847B
Q43 N017 VCOBIAS1 N023 0 BC847B
Q45 PT1 PT2 N017 0 BC847B
R11 N023 0 100
Q46 PT2 VREF N015 0 BC847B
Q47 N015 VCOBIAS1 N026 0 BC847B
Q48 N011 PT1 N015 0 BC847B
R12 N026 0 100
Q56 N041 N043 N045 0 BC847B
Q57 N045 VCOBIAS2 N051 0 BC847B
Q58 N036 PT2 N045 0 BC847B
R20 N041 N043 470
R21 N051 0 100
R22 N043 VREF 2
Q59 N034 N032 COM 0 BC857B
Q60 N032 N032 COM 0 BC857B
Q61 N036 N036 N034 0 BC857B
Q62 N041 N036 N032 0 BC857B
XU2 N041 N037 COM 0 N037 MCP6021  ; pins In+ In- V+ V- OUT
Q63 N041 N043 N044 0 BC847B
Q64 N044 VCOBIAS1 N050 0 BC847B
Q65 N036 VREF N044 0 BC847B
R10 N050 0 100
Q10 N013 N009 N005 0 BC857B
Q12 N009 N009 N004 0 BC857B
Q23 0 PT2 N013 0 BC857B
Q24 COM PT2 N020 0 BC847B
Q25 N021 N020 SENSE3 0 BC857B
Q26 N003 N013 SENSE3 0 BC847B
R26 COM N004 470
R27 COM N005 100
R28 N029 0 470
R29 N030 0 100
Q50 N019 N019 N029 0 BC847B
Q66 N020 N019 N030 0 BC847B
R30 N009 N019 10k
Q67 N014 N003 COM 0 BC857B
Q68 N003 N003 COM 0 BC857B
Q69 N021 N021 0 0 BC847B
Q70 N014 N021 0 0 BC847B
C7 N014 0 4.7p
Q71 N022 N021 0 0 BC847B
Q72 COM N014 N022 0 BC847B
Q73 N010 N003 COM 0 BC857B
Q74 0 N014 N010 0 BC857B
Q75 N006 N010 DRIVE 0 BC847B
Q76 N031 N022 DRIVE 0 BC857B
R33 DRIVE DRVDIV 360
L2 SENSE ANT 2mH Rser=120 Cpar=1pF
C_ant2 ANT 0 10pF
R35 DRIVE SENSE 4.7
C8 N013 N020 1n
R2 N031 0 10
R3 COM N006 10
V3 VREF12 0 1.2
Q1 N042 N046 N048 0 BC847B
Q2 N048 VCOBIAS3 N056 0 BC847B
R1 N056 0 100
Q3 N035 VREF12 N048 0 BC847B
Q8 N035 N033 COM 0 BC857B
Q9 N038 N033 COM 0 BC857B
Q11 N042 DRIVE N047 0 BC847B
Q14 N035 SENSE N047 0 BC847B
Q42 0 N035 N033 0 BC857B
Q44 N042 N039 COM 0 BC857B
Q55 N049 N039 COM 0 BC857B
Q77 0 N042 N039 0 BC857B
Q83 N047 VCOBIAS3 N055 0 BC847B
R5 N055 0 100
R6 0 N035 750k
R9 COM VCOBIAS3 4.7k
Q84 VCOBIAS3 VCOBIAS3 N040 0 BC847B
R14 N040 0 100
R16 N046 VREF12 200
R24 SENSE1 N046 200
Q85 N076 N078 N081 0 BC847B
Q86 N081 VCOBIAS1 N090 0 BC847B
Q87 N069 VREF N081 0 BC847B
R36 N090 0 100
R37 N078 VREF 36
Q88 N064 N059 COM 0 BC857B
Q89 N059 N059 COM 0 BC857B
Q90 N069 N069 N064 0 BC857B
Q91 N076 N069 N059 0 BC857B
Q92 N076 VREF N080 0 BC847B
Q93 N080 VCOBIAS1 N089 0 BC847B
Q94 N069 DRVDIV2 N080 0 BC847B
R38 N089 0 100
C1 N076 0 1000p
R31 DSHIFT N078 300
R40 DRVDIV VREF 12
C3 PT1 0 1000p
Q49 N015 VCOBIAS1 N027 0 BC847B
R13 N027 0 100
Q95 N015 VCOBIAS1 N025 0 BC847B
R41 N025 0 100
R44 DRIVE DRVDIV2 2k
R47 DRVDIV2 VREF 56
XU1 N076 DSHIFT COM 0 DSHIFT MCP6021  ; pins In+ In- V+ V- OUT
Q15 SENSE1 VCOBIAS3 N054 0 BC847B
R4 N054 0 100
Q22 COM N038 SENSE1 0 BC847B
C4 N038 0 4.7p
Q81 N083 VREF12 N088 0 BC847B
Q82 N088 VCOBIAS1 N093 0 BC847B
R32 N093 0 100
Q97 N082 SENSE1 N088 0 BC847B
Q107 N086 N079 0 0 BC847B
Q108 N079 N079 0 0 BC847B
C6 PSHIFT 0 20n
Q112 N070 VREF N082 0 BC847B
Q113 N068 DSHIFT N082 0 BC847B
Q114 N070 DSHIFT N083 0 BC847B
Q115 N068 VREF N083 0 BC847B
Q100 N077 N077 N086 0 BC847B
Q101 PSHIFT N077 N079 0 BC847B
Q104 N065 N060 COM 0 BC857B
Q105 N060 N060 COM 0 BC857B
Q106 N070 N070 N065 0 BC857B
Q109 N077 N070 N060 0 BC857B
Q98 N063 N058 COM 0 BC857B
Q102 N058 N058 COM 0 BC857B
Q103 N068 N068 N063 0 BC857B
Q116 PSHIFT N068 N058 0 BC857B
Q4 N074 N074 N084 0 BC847B
Q5 N084 VCOBIAS1 N091 0 BC847B
Q6 N071 PSHIFT N084 0 BC847B
R18 N091 0 100
Q7 N066 N061 COM 0 BC857B
Q13 N061 N061 COM 0 BC857B
Q16 N071 N071 N066 0 BC857B
Q17 N074 N071 N061 0 BC857B
Q18 N075 N075 N085 0 BC847B
Q19 N085 VCOBIAS1 N092 0 BC847B
Q20 N072 N074 N085 0 BC847B
R23 N092 0 100
Q21 N067 N062 COM 0 BC857B
Q96 N062 N062 COM 0 BC857B
Q117 N072 N072 N067 0 BC857B
Q118 N075 N072 N062 0 BC857B
C9 N075 0 10n
C10 VCTL N074 10n
XU3 N075 VCTL COM 0 VCTL MCP6021  ; pins In+ In- V+ V- OUT
Q51 N057 N053 0 0 BC847B
Q78 N053 N053 0 0 BC847B
Q79 N049 N049 N057 0 BC847B
Q80 N038 N049 N053 0 BC847B
R25 N073 VCTL 30k
R34 COM N073 8.2k
Q119 N073 VCOBIAS1 N087 0 BC847B
Q120 COM N073 VCOBIAS1 0 BC847B
R42 N087 0 100
R15 DRVDIV SENSE3 30
R19 N068 0 300k
.model NPN NPN
.model PNP PNP
.lib standard.bjt
.tran 0 20m 100u 10n
* Theremin Current Sensing Oscillator with PLL.
.ic V(PT1)=2.242
.ic V(PT2)=2.255
* Operational amplifier with current feedback.
* Increase amplitude from 0.1Vpp to 2.7Vpp and drive LC tank.
* Amplitude limiter on OTA
* Variable Frequency
* Bandpass Filter.
* Has zero phase shift
* on middle frequency.
* Current Feedback Instrumentation Amplifier Current Sensor
* Phase shifting integrator
* Produces DRIVE signal copy
* delayed by 90 degrees
.ic V(PSHIFT)=2.25
* Sallen-Key 2nd order LP filter for VCO control voltage
* Phase detector:
* Analog multiplier with integrating output
* Control Voltage
* to current
* converter
.lib MCP6021.cir
.backanno
.end